# EAGLE design LCD_board (EAGLE 6.6.0)
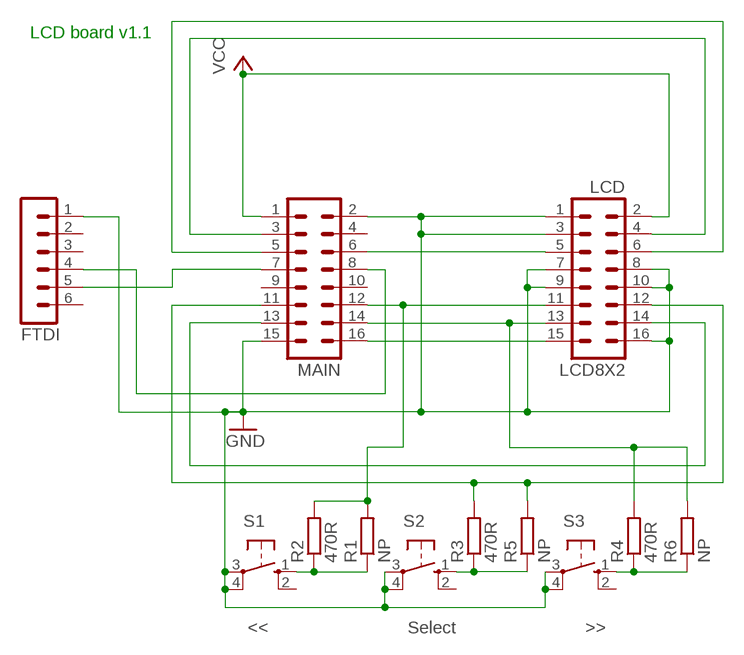
[diagram p0: schematic, sheet 1]

## Parts
FTDI  MA06-1  [MA06-1]
LCD8X2  LCD  MA08-2  [MA08-2]
MAIN  MA08-2  [MA08-2]
R1  NP  R-EU_0204/7  [0204/7]
R2  470R  R-EU_R0805  [R0805]
R3  470R  R-EU_R0805  [R0805]
R4  470R  R-EU_R0805  [R0805]
R5  NP  R-EU_0204/7  [0204/7]
R6  NP  R-EU_0204/7  [0204/7]
S1  <<  10-XX  [B3F-10XX]
S2  Select  10-XX  [B3F-10XX]
S3  >>  10-XX  [B3F-10XX]

## Nets
GND: FTDI.1 LCD8X2.1 LCD8X2.3 LCD8X2.7 LCD8X2.8 LCD8X2.9 LCD8X2.10 LCD8X2.16 MAIN.2 MAIN.15 S1.3(P) S1.4(P1) S2.3(P) S2.4(P1) S3.3(P) S3.4(P1)
N$1: FTDI.5 MAIN.7
N$2: LCD8X2.15 MAIN.16
N$3: LCD8X2.13 MAIN.14 R4.2 R6.2
N$4: LCD8X2.11 MAIN.12 R1.2 R2.2
N$6: LCD8X2.14 MAIN.13
N$8: LCD8X2.12 MAIN.11 R3.2 R5.2
N$9: LCD8X2.5 MAIN.6
N$10: LCD8X2.6 MAIN.5
N$11: LCD8X2.4 MAIN.3
N$12: FTDI.4 MAIN.8
N$13: R1.1 R2.1 S1.1(S)
N$14: R3.1 R5.1 S2.1(S)
N$15: R4.1 R6.1 S3.1(S)
VCC: LCD8X2.2 MAIN.1
Unconnected: FTDI.2 FTDI.3 FTDI.6 MAIN.4 MAIN.9 MAIN.10 S1.2(S1) S2.2(S1) S3.2(S1)

## Notes on the sheet
- LCD board v1.1

## Library data of the parts
FTDI = con-lstb:MA06-1: PIN HEADER; OC_FARNELL: unknown; OC_NEWARK: unknown
LCD8X2 MAIN = con-lstb:MA08-2: PIN HEADER; OC_FARNELL: unknown; OC_NEWARK: unknown
R1-R6 = resistor:R-EU_: RESISTOR, European symbol
S1-S3 = switch-omron:10-XX: OMRON SWITCH; MPN: B3F-1000; OC_FARNELL: 176432; OC_NEWARK: 36M3542

## Board
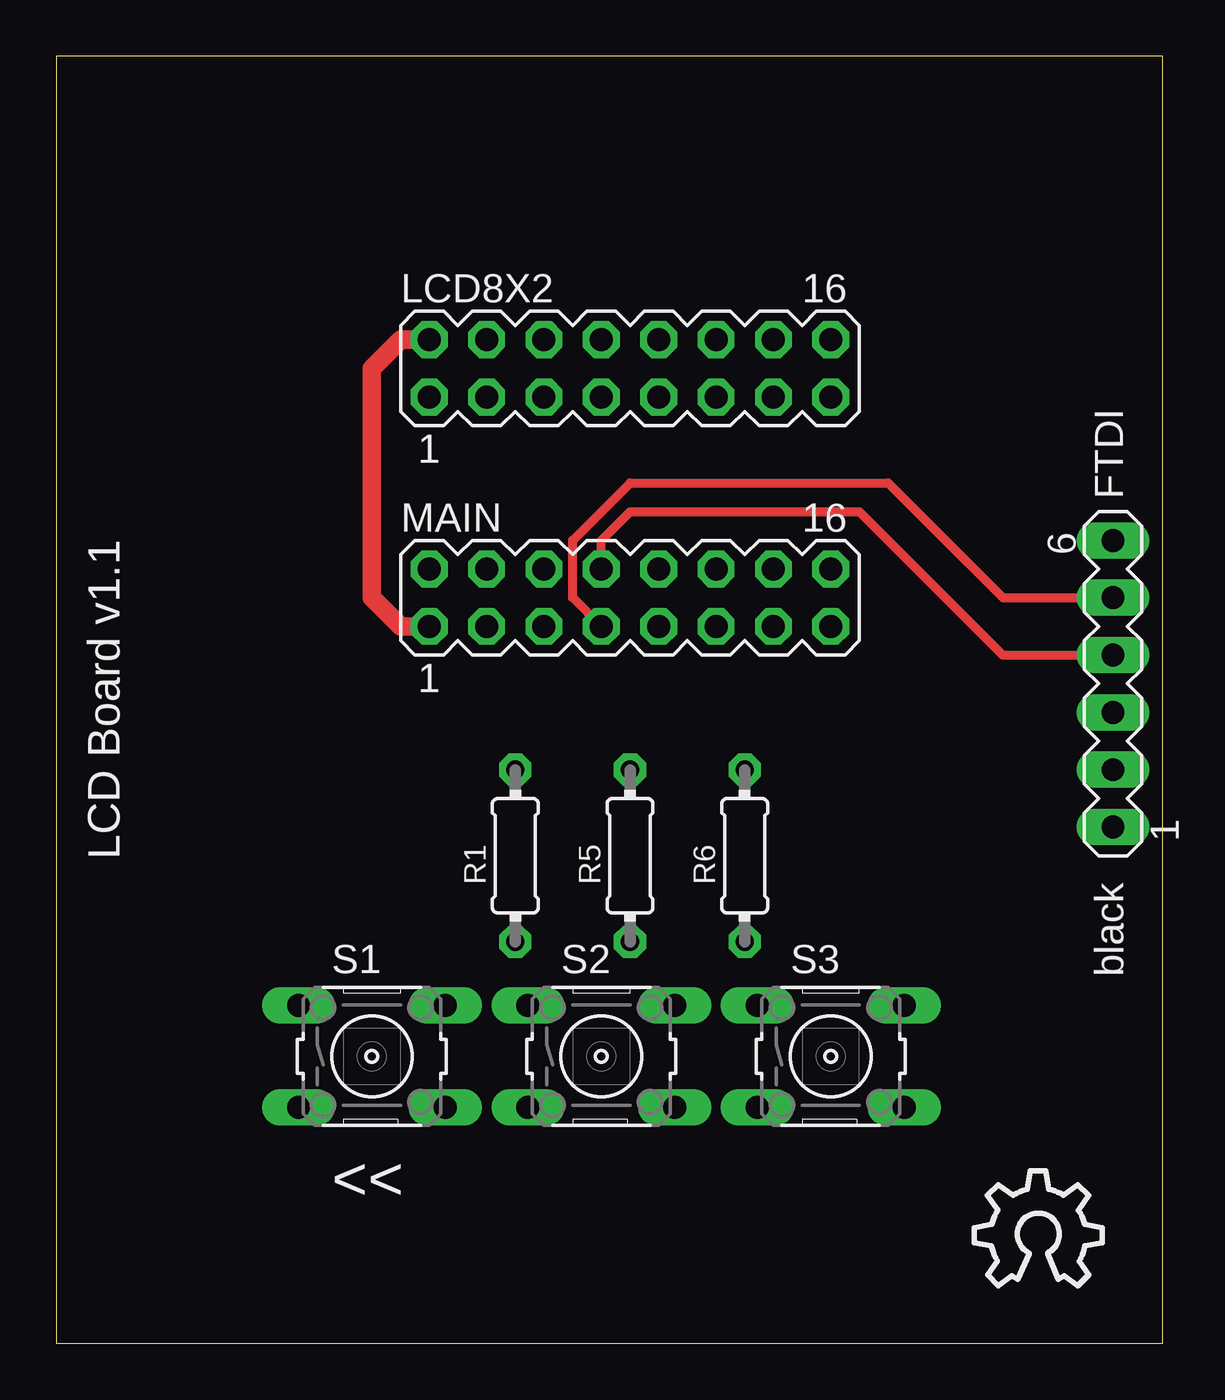
[diagram p1: board, top side]
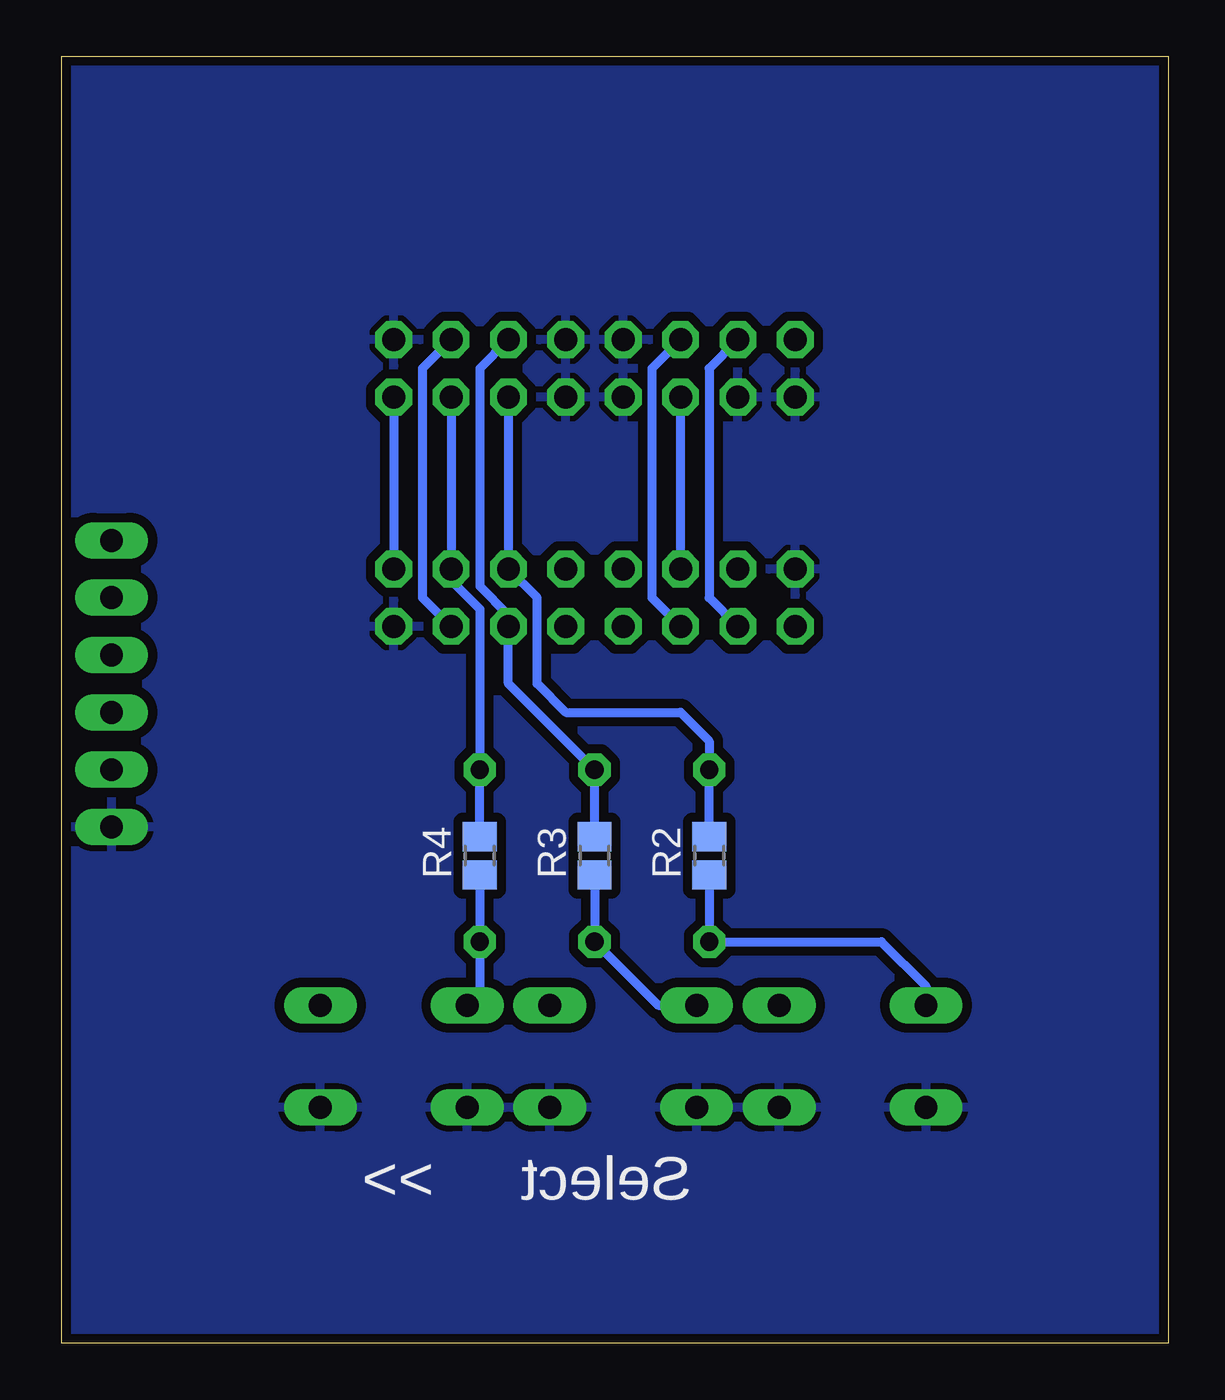
[diagram p2: board, bottom side, seen from below]

Size 49 x 57 mm. Coordinates in mm from the lower left corner, seen from the top.
Outline: 0,0 49,0 49,57 0,57 0,0
Copper layers (1*16): Top 0.035mm / dielectric 1.5mm / Bottom 0.035mm
Design rules "SparkFun": minimum track width 8mil, minimum drill 20mil, track to track 8mil, track to pad 8mil, pad to pad 8mil, via to via 8mil, smd to smd 8mil, copper to edge 10mil, drill to drill 8mil, minimum pad ring 12mil, minimum via ring 10mil, stop-mask expansion 4mil, vias tented up to drill 25mil, thermal gap 10mil

### Footprints (pad centres in the part's own frame; a part is rotated, then mirrored left to right if it is on the bottom)
MA06-1 = drill 1.016 long: 1 -6.35,0; 2 -3.81,0; 3 -1.27,0; 4 1.27,0; 5 3.81,0; 6 6.35,0
MA08-2 = drill 1.016 octagon: 1 -8.89,-1.27; 2 -8.89,1.27; 3 -6.35,-1.27; 4 -6.35,1.27; 5 -3.81,-1.27; 6 -3.81,1.27; 7 -1.27,-1.27; 8 -1.27,1.27; 9 1.27,-1.27; 10 1.27,1.27; 11 3.81,-1.27; 12 3.81,1.27; 13 6.35,-1.27; 14 6.35,1.27; 15 8.89,-1.27; 16 8.89,1.27
0204/7 = drill 0.813 octagon: 1 -3.81,0; 2 3.81,0
R0805 = smd 1.3 x 1.5: 1 -0.85,0; 2 0.85,0
B3F-10XX = drill 1.016 long: 1 -3.251,2.261; 2 3.251,2.261; 3 -3.251,-2.261; 4 3.251,-2.261

### Placement (x,y rotation side)
FTDI  46.79,29.21 90 top
LCD8X2  25.4,43.18 0 top
MAIN  25.4,33.02 0 top
R1  20.32,21.59 90 top
R2  20.32,21.59 90 bottom
R3  25.4,21.59 90 bottom
R4  30.48,21.59 90 bottom
R5  25.4,21.59 90 top
R6  30.48,21.59 90 top
S1  13.97,12.7 0 top
S2  24.13,12.7 0 top
S3  34.29,12.7 0 top
U$1  [OSHW_10X200_NOTEXT]  40.64,2.54 0 top

### Tracks (layer width: path | path; a pad name or v marks a point on that pad's centre or on a via)
GND
  pour Bottom (isolate 0.406): 0,57.15 49.53,57.15 49.53,0 0,0
N$1
  Top 0.406: MAIN.7 22.86,33.02 22.86,35.56 25.4,38.1 36.83,38.1 41.91,33.02 FTDI.5
N$2
  Bottom 0.406: LCD8X2.15 MAIN.16
N$3
  Bottom 0.406: LCD8X2.13 MAIN.14 31.75,33.78 30.48,32.51 R6.2 R4.2
N$4
  Bottom 0.406: LCD8X2.11 MAIN.12 27.94,33.02 27.94,29.21 26.67,27.94 21.59,27.94 20.32,26.67 R1.2 R2.2
N$6
  Bottom 0.406: LCD8X2.14 33.02,43.18 33.02,33.02 MAIN.13
N$8
  Bottom 0.406: LCD8X2.12 30.48,43.18 30.48,33.53 29.21,32.26 MAIN.11 29.21,29.21 R5.2 R3.2
N$9
  Bottom 0.406: MAIN.6 LCD8X2.5
N$10
  Bottom 0.406: LCD8X2.6 22.86,43.18 22.86,33.02 MAIN.5
N$11
  Bottom 0.406: LCD8X2.4 20.32,43.18 20.32,33.02 MAIN.3
N$12
  Top 0.406: MAIN.8 24.13,35.56 25.4,36.83 35.56,36.83 41.91,30.48 FTDI.4
N$13
  Bottom 0.406: R2.1 R1.1 12.7,17.78 10.72,15.8 S1.1
N$14
  Bottom 0.406: R3.1 R5.1 22.58,14.96 S2.1
N$15
  Bottom 0.406: R4.1 R6.1 30.48,15.24 30.76,14.96 S3.1
VCC
  Top 0.813: MAIN.1 15.24,31.75 13.97,33.02 13.97,43.18 15.24,44.45 LCD8X2.2

### Text on the board
tNames: LCD Board v1.1 | black